# EAGLE design level-shifter-v0.1 (EAGLE 7.3.0)
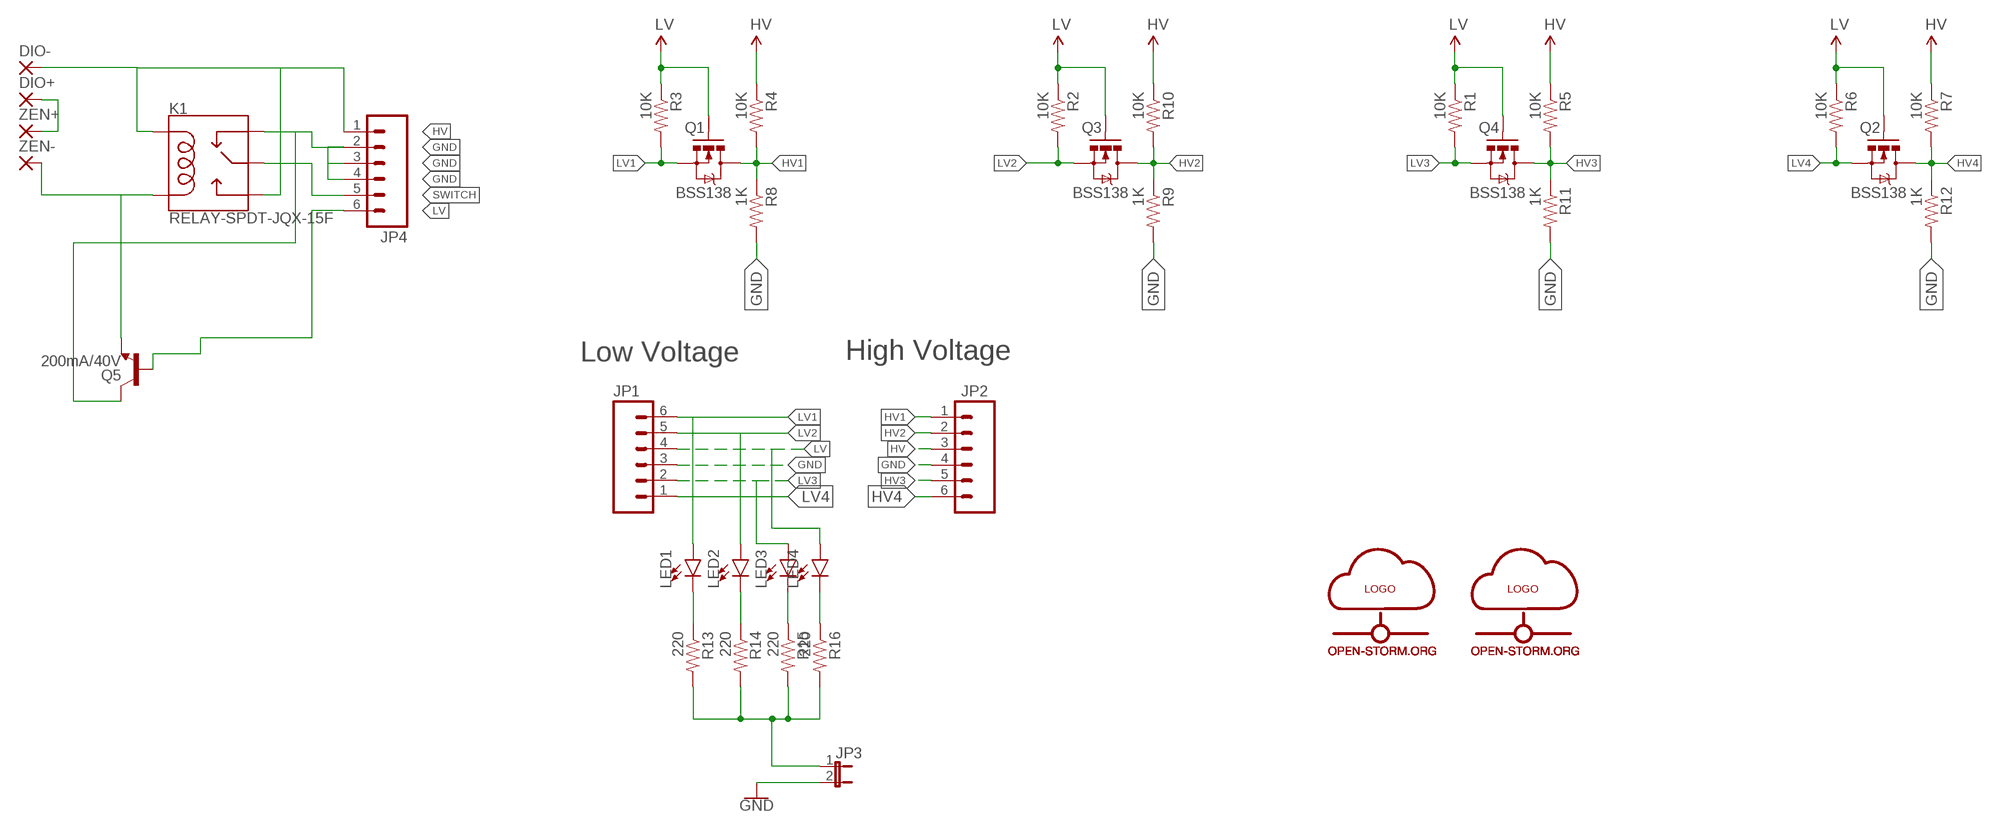
[diagram p0: schematic, sheet 1]

## Parts
DIO+  2,15/1,0  [2,15/1,0]
DIO-  2,15/1,0  [2,15/1,0]
JP1  M06SIP  [1X06]
JP2  M06SIP  [1X06]
JP3  JUMPER-2PTH  [1X02]
JP4  M06SIP  [1X06]
K1  RELAY-SPDT-JQX-15F  [RELAY-T90]
LED1  LED5MM  [LED_5MM]
LED2  LED5MM  [LED_5MM]
LED3  LED5MM  [LED_5MM]
LED4  LED5MM  [LED_5MM]
Q1  BSS138  MOSFET-NCHANNELPTH  [TO-92]
Q2  BSS138  MOSFET-NCHANNELPTH  [TO-92]
Q3  BSS138  MOSFET-NCHANNELPTH  [TO-92]
Q4  BSS138  MOSFET-NCHANNELPTH  [TO-92]
Q5  200mA/40V  TRANS_NPN-2N3904  [TO-92]
R1  10K  RESISTORPTH-1/4W  [AXIAL-0.4]
R2  10K  RESISTORPTH-1/4W  [AXIAL-0.4]
R3  10K  RESISTORPTH-1/4W  [AXIAL-0.4]
R4  10K  RESISTORPTH-1/4W  [AXIAL-0.4]
R5  10K  RESISTORPTH-1/4W  [AXIAL-0.4]
R6  10K  RESISTORPTH-1/4W  [AXIAL-0.4]
R7  10K  RESISTORPTH-1/4W  [AXIAL-0.4]
R8  1K  RESISTORPTH-1/4W  [AXIAL-0.4]
R9  1K  RESISTORPTH-1/4W  [AXIAL-0.4]
R10  10K  RESISTORPTH-1/4W  [AXIAL-0.4]
R11  1K  RESISTORPTH-1/4W  [AXIAL-0.4]
R12  1K  RESISTORPTH-1/4W  [AXIAL-0.4]
R13  220  RESISTORPTH-1/4W  [AXIAL-0.4]
R14  220  RESISTORPTH-1/4W  [AXIAL-0.4]
R15  220  RESISTORPTH-1/4W  [AXIAL-0.4]
R16  220  RESISTORPTH-1/4W  [AXIAL-0.4]
U$1  OPEN-STORM-LOGO  [OPEN-STORM-LOGO]
U$2  OPEN-STORM-LOGO-SMALL  [OPEN-STORM-LOGO-SMALL]
ZEN+  2,15/1,0  [2,15/1,0]
ZEN-  2,15/1,0  [2,15/1,0]

## Nets
GND: JP1.3 JP2.4 JP3.2 JP4.2 JP4.3 JP4.4 K1.NC Q5.3(C) R8.P$2 R9.P$2 R11.P$2 R12.P$2
HV: DIO-.1(P) JP2.3 JP4.1 K1.COIL1 K1.NO R4.P$1 R5.P$1 R7.P$1 R10.P$1
HV1: JP2.1 Q1.1(D) R4.P$2 R8.P$1
HV2: JP2.2 Q3.1(D) R9.P$1 R10.P$2
HV3: JP2.5 Q4.1(D) R5.P$2 R11.P$1
HV4: JP2.6 Q2.1(D) R7.P$2 R12.P$1
LV: JP1.4 JP4.6 LED4.A Q1.3(G) Q2.3(G) Q3.3(G) Q4.3(G) Q5.2(B) R1.P$1 R2.P$1 R3.P$1 R6.P$1
LV1: JP1.6 LED1.A Q1.2(S) R3.P$2
LV2: JP1.5 LED2.A Q3.2(S) R2.P$2
LV3: JP1.2 LED3.A Q4.2(S) R1.P$2
LV4: JP1.1 Q2.2(S) R6.P$2
N$1: DIO+.1(P) ZEN+.1(P)
N$2: LED4.K(C) R16.P$1
N$3: LED2.K(C) R14.P$1
N$4: K1.COIL2 Q5.1(E) ZEN-.1(P)
N$5: LED1.K(C) R13.P$1
N$6: LED3.K(C) R15.P$1
N$8: JP3.1 R13.P$2 R14.P$2 R15.P$2 R16.P$2
SWITCH: JP4.5 K1.MAIN

## Notes on the sheet
- Low Voltage | High Voltage

## Library data of the parts
DIO+ DIO- ZEN+ ZEN- = wirepad:2,15/1,0: THROUGH-HOLE PAD
JP1 JP2 JP4 = SparkFun:M06: Header 6 Standard 6-pin 0.1" header. Use with straight break away headers (SKU : PRT-00116), right angle break away headers (PRT-00553), swiss pins (PRT-00743), machine pins (PRT-00117), and female headers (PRT-00115). Molex polarized connector foot print use with SKU : PRT-08094 with associated crimp pins and housings. NOTES ON THE VARIANTS LOCK and LOCK_LONGPADS... This footprint was designed to help hold the alignment of a through-hole component (i.e. 6-pin header) while soldering it into place. You may notice that each hole has been shifted either up or down by 0.005 of an inch from it's more standard position (which is a perfectly straight line). This slight alteration caused the pins (the squares in the middle) to touch the edges of the holes. Because they are alternating, it causes a "brace" to hold the component in place. 0.005 has proven to be the perfect amount of "off-center" position when using our standard breakaway headers. Although looks a little odd when you look at the bare footprint, once you have a header in there, the alteration is very hard to notice. Also, if you push a header all the way into place, it is covered up entirely on the bottom side. This idea of altering the position of holes to aid alignment will be further integrated into the Sparkfun Library for other footprints. It can help hold any component with 3 or more connection pins.
JP3 = SparkFun:JUMPER-2: Jumper Basic 0.1" spaced jumper. Use with breakaway headers.
K1 = SparkFun-Electromechanical:RELAY-SPDT: SPDT Electromechanical Relay Single-pole, double-throw sealed relays. When current is applied to the coil, it throws a simple changeover switch, terminating the connection from the NC contact to ground and closing the NO contact. Use them to switch high voltage/high current devices. SparkFun Products JQX-15F: Relay SPDT Sealed - 20A <https://www.sparkfun.com/products/10924> (COM-10924) JZC-11F: Relay SPDT Sealed <https://www.sparkfun.com/products/100> (COM-00100); PROD_ID: COMP-10736; SF_SKU: COM-10924
LED1-LED4 = SparkFun-LED:LED: LED (Generic) Standard schematic elements and footprints for 5mm, 3mm, 1206, and 0603 sized LEDs. Generic LEDs with no color specified.
Q1-Q4 = SparkFun:MOSFET-NCHANNEL
Q5 = SparkFun-DiscreteSemi:TRANS_NPN: NPN transistor Current controlled devices typically used to amplify current or used as a switch. BC547 - COM-08928 <http://www.sparkfun.com/products/8928> (TO-92 45V 100mA) (1.Collector 2.Base 3.Emitter) 2N3904 - COM-00521 <http://www.sparkfun.com/products/521> (TO-92 40V 200mA) (1.Emitter 2.Base 3.Collector) P2N2222A - COM-12852 <http://www.sparkfun.com/products/12852> (TO-92 40V 600mA) (1.Collector 2.Base 3.Emitter); PROD_ID: TRANS-08447
R1-R16 = SparkFun:RESISTOR: Resistor Basic schematic elements and footprints for 0603, 1206, and PTH resistors.
U$1 = open-storm-lib:OPEN-STORM-LOGO: open-storm logo for PCB
U$2 = open-storm-lib:OPEN-STORM-LOGO-SMALL

## Board
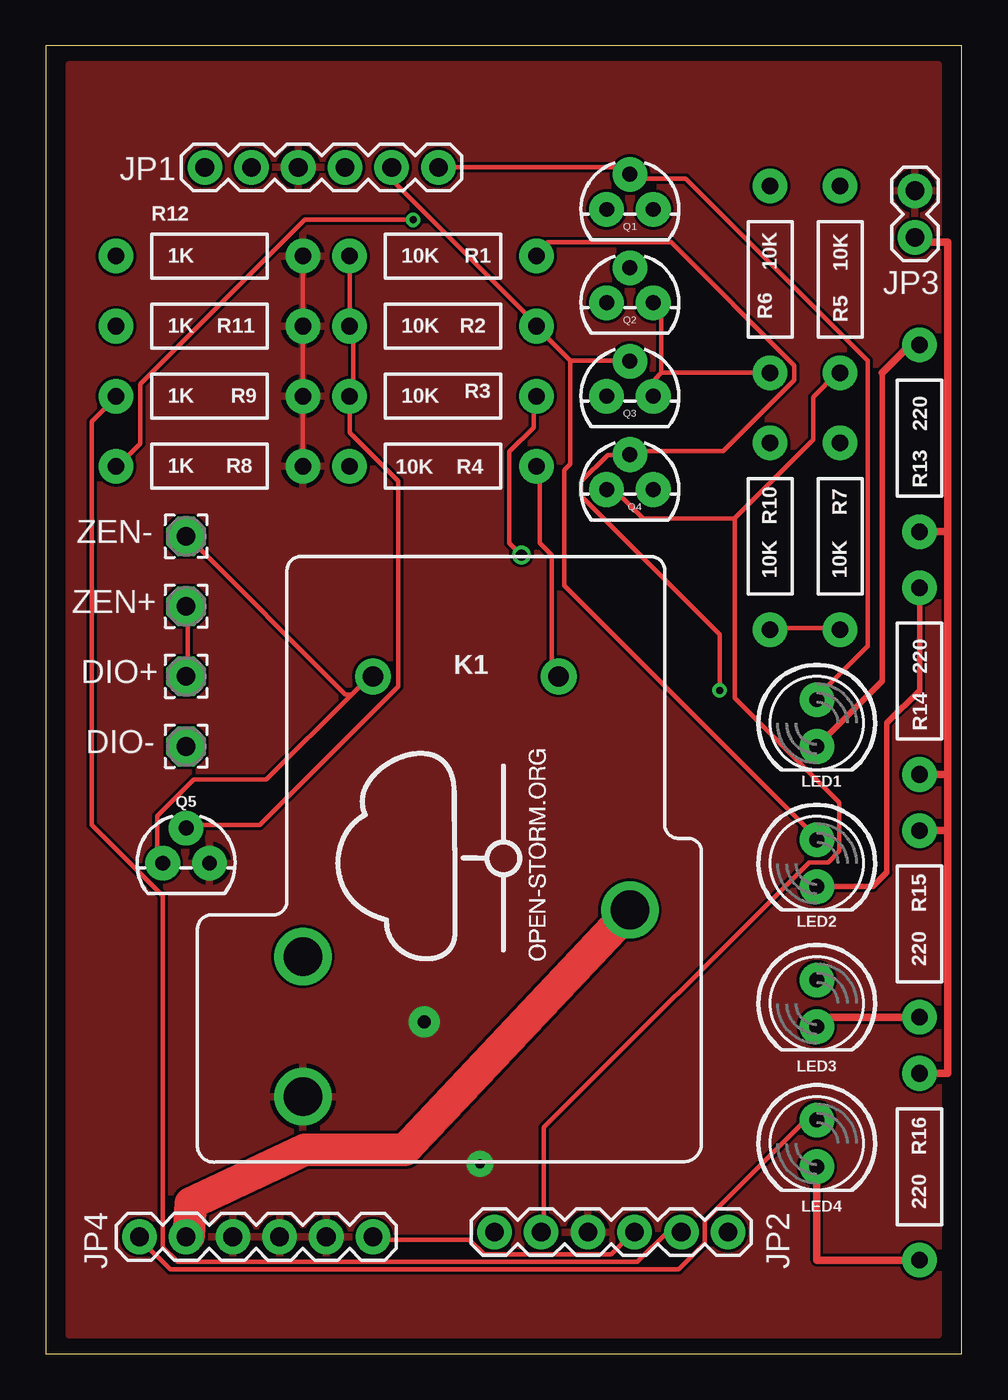
[diagram p1: board, top side]
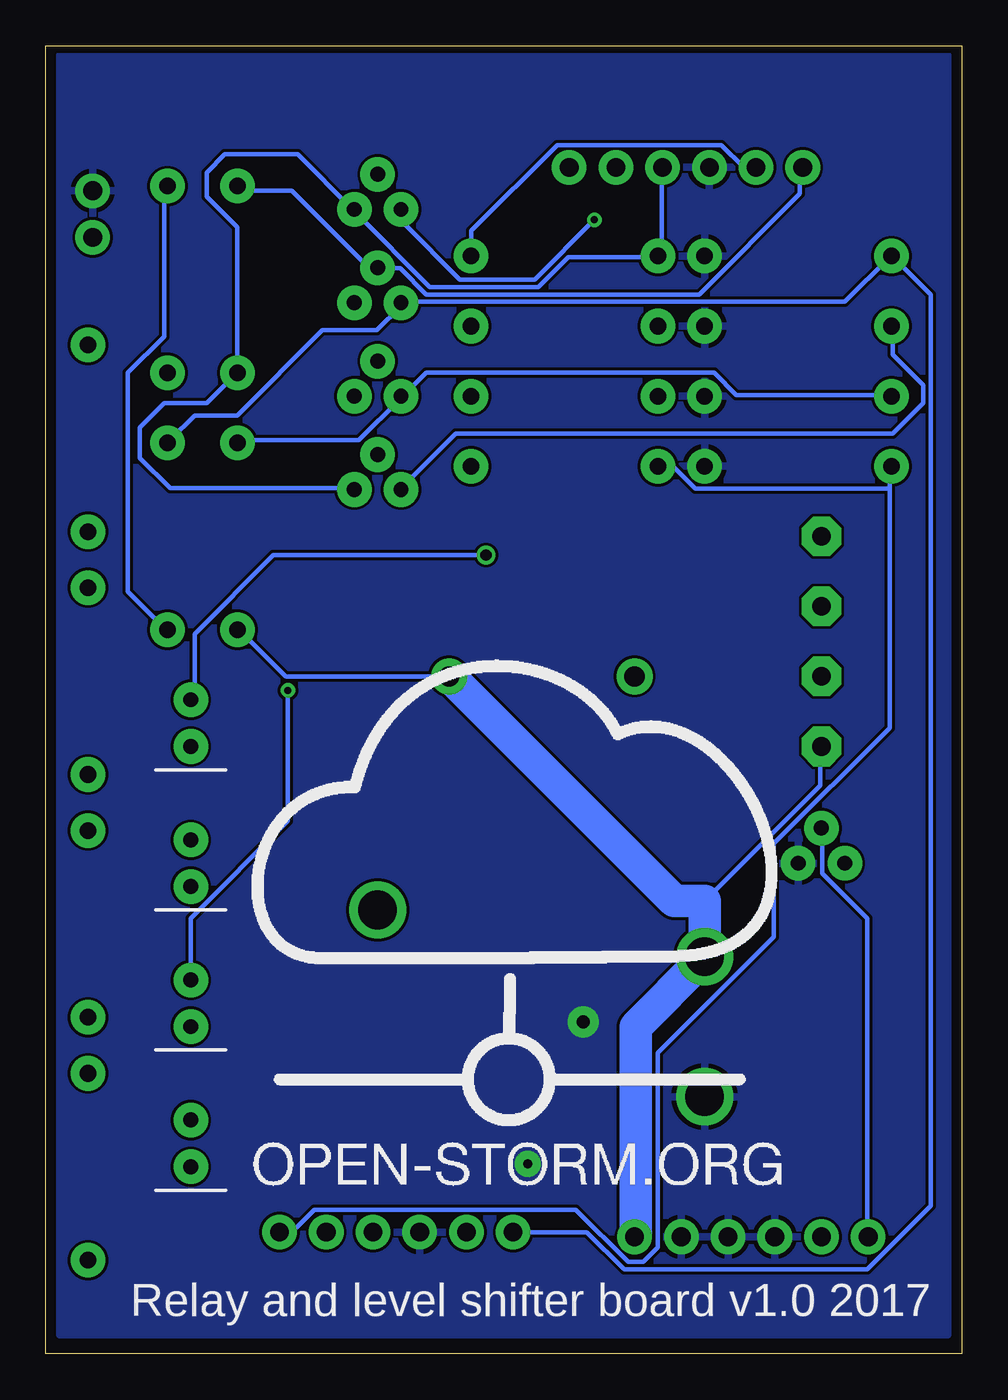
[diagram p2: board, bottom side, seen from below]

Size 49.78 x 71.12 mm. Coordinates in mm from the lower left corner, seen from the top.
Outline: 0,0 49.78,0 49.78,71.12 0,71.12 0,0
Copper layers (1*16): Top 0.035559375mm / dielectric 1.501140625mm / Bottom 0.035559375mm
Design rules "typical_4pcb": minimum track width 10mil, minimum drill 15mil, track to track 6mil, track to pad 6mil, pad to pad 6mil, via to via 6mil, smd to smd 6mil, copper to edge 15mil, drill to drill 8mil, minimum pad ring 10mil, minimum via ring 8mil, stop-mask expansion 4mil, vias tented up to drill 0mil, thermal gap 10mil

### Footprints (pad centres in the part's own frame; a part is rotated, then mirrored left to right if it is on the bottom)
2,15/1,0 = drill 1.016 pad 2.159 octagon: 1 0,0
1X06 = drill 1.016 pad 1.88: 1 0,0; 2 2.54,0; 3 5.08,0; 4 7.62,0; 5 10.16,0; 6 12.7,0
1X02 = drill 1.016 pad 1.88: 1 0,0; 2 2.54,0
RELAY-T90 = drill 1.1 pad 1.956: COIL1 0,-13.9; COIL2 0,-3.81 | drill 2.1: MAIN -12.7,-17.78; NC -22.86,0; NO -15.24,0
LED_5MM = drill 0.813 pad 1.88: A -1.27,0; K 1.27,0
TO-92 = drill 0.813 pad 1.88: 1 -1.27,0; 2 0,1.905; 3 1.27,0
AXIAL-0.4 = drill 0.9 pad 1.88: P$1 -5.08,0; P$2 5.08,0

### Placement (x,y rotation side)
DIO+  7.62,36.83 0 top
DIO-  7.62,33.02 0 top
JP1  8.64,64.52 0 top
JP2  37.08,6.6 180 top
JP3  47.24,60.71 90 top
JP4  17.78,6.35 180 top
K1  13.97,36.83 90 top
LED1  41.91,34.29 270 top
LED2  41.91,26.67 270 top
LED3  41.91,19.05 270 top
LED4  41.91,11.43 270 top
Q1  31.75,62.23 0 top
Q2  31.75,57.15 0 top
Q3  31.75,52.07 0 top
Q4  31.75,46.99 0 top
Q5  7.62,26.67 0 top
R1  21.59,59.69 0 top
R2  21.59,55.88 0 top
R3  21.59,52.07 0 top
R4  21.59,48.26 180 top
R5  43.18,58.42 270 top
R6  39.37,58.42 90 top
R7  43.18,44.45 90 top
R8  8.89,48.26 0 top
R9  8.89,52.07 0 top
R10  39.37,44.45 90 top
R11  8.89,55.88 0 top
R12  8.89,59.69 0 top
R13  47.5,49.78 270 top
R14  47.5,36.58 270 top
R15  47.5,23.37 90 top
R16  47.5,10.16 90 top
U$1  38.61,9.14 0 bottom
U$2  27.18,21.34 90 top
ZEN+  7.62,40.64 0 top
ZEN-  7.62,44.45 0 top

### Tracks (layer width: path | path; a pad name or v marks a point on that pad's centre or on a via)
GND  (via drill 0.5 pad 1.42, 0.7 pad 1.68)
  Top 0.254: R8.P$2 R9.P$2 R11.P$2 R12.P$2 13.97,59.94 14.63,59.94 | 13.97,14.05 K1.NC
  Bottom 0.254: 13.97,59.61 R12.P$2
  other vias: 20.57,18.03 23.6,10.31
  pour Bottom: 0.76,70.61 49.02,70.61 49.02,68.58 49.02,1.02 0.76,1.02
  pour Top: 1.27,70.1 48.51,70.1 48.51,1.02 1.27,1.02
HV
  Top 0.254: R4.P$1 26.85,48.06 26.85,44.09 27.51,43.43 27.51,37.16 27.84,36.83 K1.COIL1 | R10.P$1 39.39,39.47 43.03,39.47 R7.P$1 | JP4.1 17.93,6.2 23.01,6.2 23.82,5.39 30.73,5.39 31.95,6.6 JP2.3
  Bottom 0.254: 13.97,24.61 7.7,30.89 7.7,32.87 DIO-.1 | R5.P$1 43.36,63.25 43.36,55.32 45.34,53.34 45.34,41.45 43.36,39.47 R7.P$1 | R10.P$1 39.06,39.14 36.75,36.83 K1.COIL1 27.84,36.83 | 17.73,6.4 JP4.1 | 14.07,21.44 K1.NO
  Bottom 1.778: K1.NO 13.97,24.61 15.62,24.61 27.84,36.83 | 17.73,6.4 17.73,17.78 14.07,21.44
HV1  (via drill 0.38)
  Top 0.254: v19.96,61.67 14.07,61.67 5.13,52.73 5.13,49.48 3.91,48.26 R8.P$1
  Bottom 0.254: JP2.1 36.42,6.6 35.2,7.82 20.98,7.82 18.14,4.98 17.32,4.98 16.51,5.79 16.51,16.36 10.21,22.66 10.21,27.74 3.91,34.04 3.91,47.04 | 3.91,47.04 3.91,48.26 R8.P$1 | R4.P$2 15.7,48.26 14.48,47.04 3.91,47.04 | v19.96,61.67 23.22,58.42 27.28,58.42 30.33,61.47 30.33,62.08 Q1.1
HV2
  Top 0.254: JP2.2 33.78,6.6 32.16,4.98 7.16,4.98 6.35,5.79 6.35,24.89 2.49,28.75 2.49,50.7 3.71,51.92 R9.P$1
  Bottom 0.254: R9.P$1 3.91,52.12 12.24,52.12 13.46,53.34 29.11,53.34 30.33,52.12 Q3.1 30.53,51.92 32.77,49.68 39.27,49.68 R10.P$2
HV3
  Top 0.254: 37.41,45.42 32.46,45.42 31.14,46.74 30.48,46.74 Q4.1 | 37.41,45.42 41.71,49.71 41.71,52.02 43.03,53.34 R5.P$2 | JP2.5 27.08,6.6 27.08,12.29 41.5,26.72 42.52,26.72 43.13,27.33 43.13,29.97 37.44,35.66 37.44,45.42 37.41,45.42
  Bottom 0.254: R11.P$1 3.73,55.65 3.73,54.33 2.08,52.68 2.08,51.69 3.73,50.04 27.51,50.04 30.48,47.07 Q4.1
HV4
  Bottom 0.254: R7.P$2 43.03,49.71 41.71,51.03 39.39,51.03 34.77,55.65 31.8,55.65 30.48,56.97 Q2.1 30.33,57.2 6.35,57.2 3.91,59.64 R12.P$1 3.71,59.64 1.68,57.61 1.68,8.03 5.13,4.57 18.34,4.57 20.37,6.6 JP2.6
LV
  Top 0.254: 33.45,53.34 33.12,53.01 33.12,52.35 Q3.3 | 33.45,53.34 33.45,56.64 33.12,56.97 Q2.3 | R6.P$1 33.45,53.34 | 16.61,52.35 R3.P$1 | 16.61,55.65 R2.P$1 | 16.61,52.02 R3.P$1 | R3.P$1 16.71,52.32 16.71,55.58 R2.P$1 | R1.P$1 R2.P$1 | LED4.A 41.3,12.7 35.81,7.21 35.81,5.99 34.39,4.57 6.76,4.57 5.13,6.2 JP4.6 | R3.P$1 16.51,50.09 19.15,47.45 19.15,36.27 11.63,28.75 7.77,28.75 Q5.2
  Bottom 0.254: 39.39,53.34 41.05,51.69 43.36,51.69 44.68,50.37 44.68,48.72 43.03,47.07 33.12,47.07 Q4.3 | 39.39,53.34 39.39,61.27 41.05,62.92 41.05,64.24 40.06,65.23 36.09,65.23 33.12,62.25 Q1.3 32.97,62.08 28.9,58.01 23.01,58.01 21.39,59.64 16.51,59.64 R1.P$1 16.51,59.84 16.31,60.05 16.31,64.52 JP1.4 | 39.39,53.34 R6.P$1 | JP4.6 5.13,6.4 5.13,23.67 7.57,26.11 7.57,28.55 Q5.2
LV1  (via drill 0.61)
  Top 0.254: v25.86,43.43 25.2,44.09 25.2,49.05 26.52,50.37 26.52,52.02 R3.P$2 | LED1.A 42.04,35.84 44.68,38.48 44.68,54 34.77,63.91 31.8,63.91 Q1.2 31.75,64.31 31.55,64.52 JP1.6
  Bottom 0.254: v25.86,43.43 37.41,43.43 41.71,39.14 41.71,35.84 LED1.A
LV2
  Top 0.254: 28.5,54 31.47,54 Q3.2 | 28.5,54 26.85,55.65 R2.P$2 26.67,55.98 18.95,63.7 18.95,64.52 JP1.5 | 28.5,54 28.5,48.39 28.17,48.06 28.17,41.78 41.71,28.25 LED2.A
LV3  (via drill 0.38)
  Top 0.254: 42.04,20.32 LED3.A | R1.P$2 26.67,59.84 27.28,60.45 33.98,60.45 40.69,53.75 40.69,52.93 36.83,49.07 31.75,49.07 Q4.2 31.75,48.87 30.53,48.87 29.11,47.45 29.11,46.63 36.63,39.12 v36.63,36.07
  Bottom 0.254: JP1.2 11.84,64.52 13.06,65.73 22,65.73 26.67,61.06 R1.P$2 | LED3.A 41.91,23.67 36.63,28.96 v36.63,36.07
LV4
  Top 0.254: 31.47,58.95 Q2.2
  Bottom 0.254: R6.P$2 39.06,63.25 36.42,63.25 32.46,59.28 31.8,59.28 Q2.2 31.75,59.03 30.53,59.03 29.11,57.61 14.28,57.61 8.79,63.09 8.79,64.52 JP1.1
N$1
  Top 0.254: DIO+.1 7.7,36.83 7.7,40.46 ZEN+.1
N$2
  Top 0.406: R16.P$1 41.91,5.08 LED4.K
N$3
  Top 0.305: LED2.K 44.96,25.4 45.72,26.16 45.72,34.29 47.5,36.07 R14.P$1
N$4
  Top 0.254: 16.61,35.84 17.6,36.83 K1.COIL2 | 16.61,35.84 11.99,31.22 8.03,31.22 6.04,29.24 6.04,26.92 Q5.1 | 16.61,35.84 16.28,35.84 7.7,44.42 ZEN-.1
N$5
  Top 0.305: LED1.K 45.47,36.58 45.47,53.34
  Top 0.406: 45.47,53.34 46.99,54.86 R13.P$1
N$6
  Top 0.406: LED3.K 42.42,18.29 R15.P$1
N$8
  Top 0.406: JP3.1 47.5,60.45 49.02,60.45 49.02,44.7 | 49.02,44.7 49.02,31.5 | 49.02,31.5 49.02,28.45 | 49.02,28.45 49.02,15.24 R16.P$2 | R13.P$2 49.02,44.7 | R14.P$2 49.02,31.5 | R15.P$2 49.02,28.45
SWITCH
  Top 0.254: 7.77,6.4 JP4.5 | 31.75,24.08 K1.MAIN
  Top 1.778: 7.77,6.4 7.87,8.18 14.07,11.07 19.51,11.07 31.75,24.08

### Text on the board
bNames: Relay and level shifter board v1.0 2017
tValues: LV4 | LV3 | LV | LV2 | LV1 | GND | LED | LV / (ON) | HV / (BAT) | HV4 | HV3 | GND | HV | HV2 | HV1 | SWC | GND | GND | GND